# EAGLE design PHOBOS-lbr (EAGLE 7.6.0)
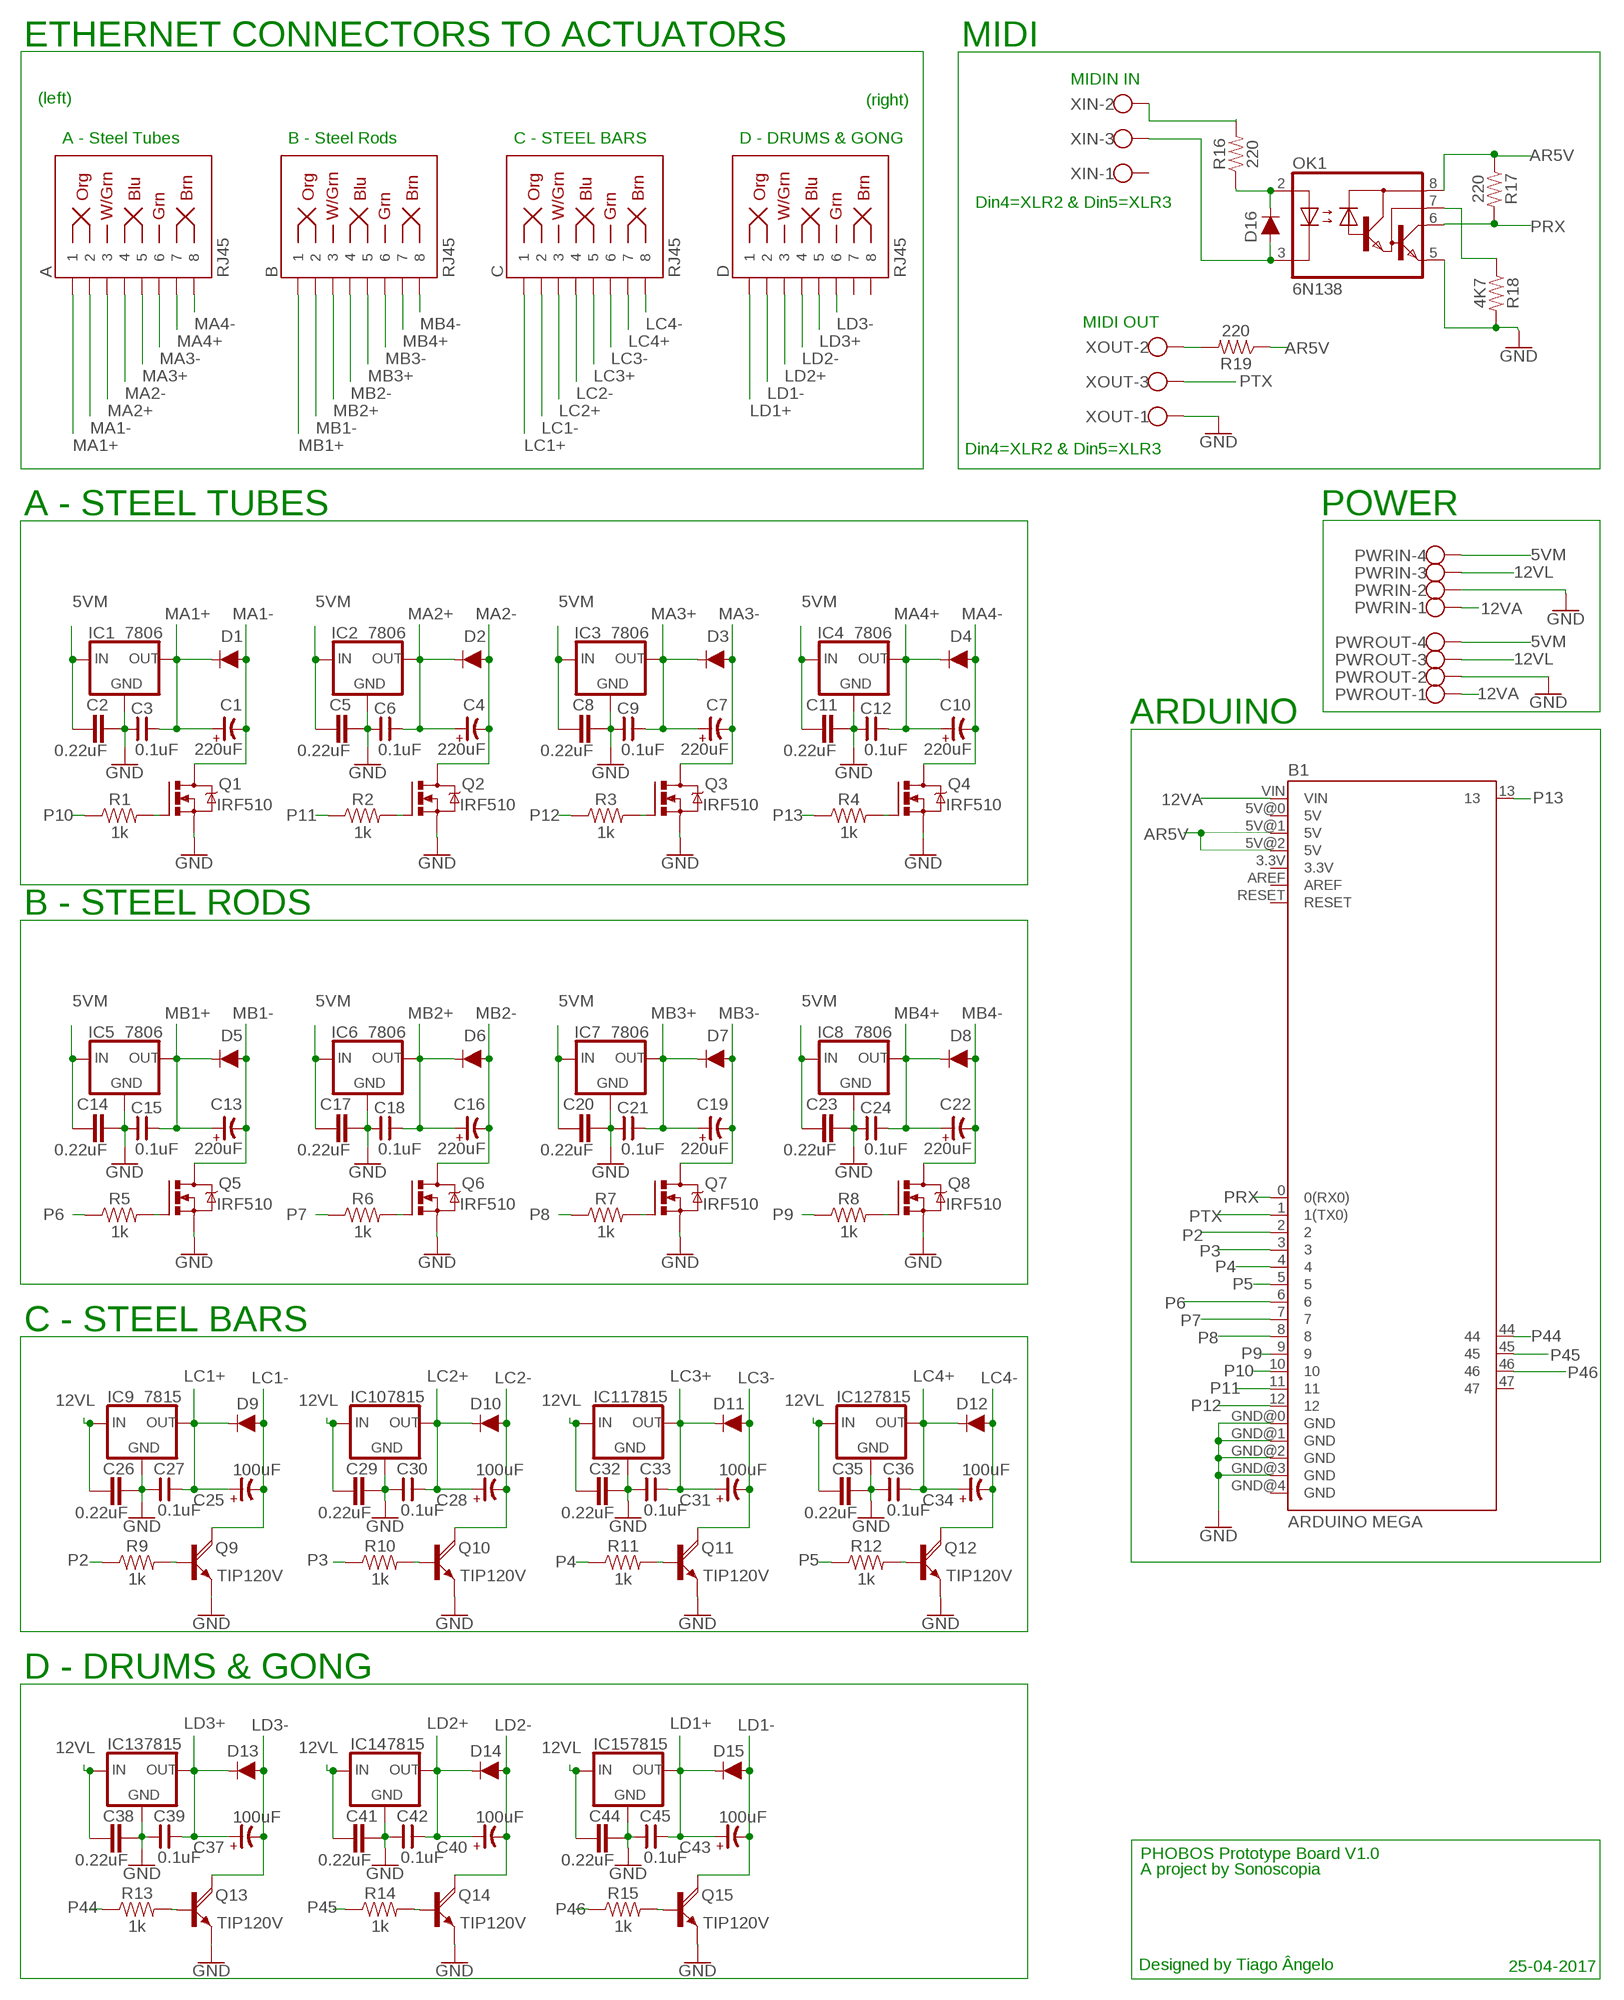
[diagram p0: schematic, sheet 1]

## Parts
A  RJ45  RJ45-8  [RJ45-8]
B  RJ45  RJ45-8  [RJ45-8]
B1  ARDUINO MEGA  ARDUINO_MEGA_R3FULL  [ARDUINO_MEGA]
C  RJ45  RJ45-8  [RJ45-8]
C1  220uF  CP-E-035X080  [E-035X080]
C2  0.22uF  C5/3  [C5B3]
C3  0.1uF  CNP-C025-050X025  [C025-050X025]
C4  220uF  CP-E-035X080  [E-035X080]
C5  0.22uF  C5/3  [C5B3]
C6  0.1uF  CNP-C025-050X025  [C025-050X025]
C7  220uF  CP-E-035X080  [E-035X080]
C8  0.22uF  C5/3  [C5B3]
C9  0.1uF  CNP-C025-050X025  [C025-050X025]
C10  220uF  CP-E-035X080  [E-035X080]
C11  0.22uF  C5/3  [C5B3]
C12  0.1uF  CNP-C025-050X025  [C025-050X025]
C13  220uF  CP-E-035X080  [E-035X080]
C14  0.22uF  C5/3  [C5B3]
C15  0.1uF  CNP-C025-050X025  [C025-050X025]
C16  220uF  CP-E-035X080  [E-035X080]
C17  0.22uF  C5/3  [C5B3]
C18  0.1uF  CNP-C025-050X025  [C025-050X025]
C19  220uF  CP-E-035X080  [E-035X080]
C20  0.22uF  C5/3  [C5B3]
C21  0.1uF  CNP-C025-050X025  [C025-050X025]
C22  220uF  CP-E-035X080  [E-035X080]
C23  0.22uF  C5/3  [C5B3]
C24  0.1uF  CNP-C025-050X025  [C025-050X025]
C25  100uF  CP-E-020X050  [E-020X050]
C26  0.22uF  C5/3  [C5B3]
C27  0.1uF  CNP-C025-050X025  [C025-050X025]
C28  100uF  CP-E-020X050  [E-020X050]
C29  0.22uF  C5/3  [C5B3]
C30  0.1uF  CNP-C025-050X025  [C025-050X025]
C31  100uF  CP-E-020X050  [E-020X050]
C32  0.22uF  C5/3  [C5B3]
C33  0.1uF  CNP-C025-050X025  [C025-050X025]
C34  100uF  CP-E-020X050  [E-020X050]
C35  0.22uF  C5/3  [C5B3]
C36  0.1uF  CNP-C025-050X025  [C025-050X025]
C37  100uF  CP-E-020X050  [E-020X050]
C38  0.22uF  C5/3  [C5B3]
C39  0.1uF  CNP-C025-050X025  [C025-050X025]
C40  100uF  CP-E-020X050  [E-020X050]
C41  0.22uF  C5/3  [C5B3]
C42  0.1uF  CNP-C025-050X025  [C025-050X025]
C43  100uF  CP-E-020X050  [E-020X050]
C44  0.22uF  C5/3  [C5B3]
C45  0.1uF  CNP-C025-050X025  [C025-050X025]
D  RJ45  RJ45-8  [RJ45-8]
D1  1A/50V/1.1V  DIODE-KIT2  [DIODE-1N4001-KIT]
D2  1A/50V/1.1V  DIODE-KIT2  [DIODE-1N4001-KIT]
D3  1A/50V/1.1V  DIODE-KIT2  [DIODE-1N4001-KIT]
D4  1A/50V/1.1V  DIODE-KIT2  [DIODE-1N4001-KIT]
D5  1A/50V/1.1V  DIODE-KIT2  [DIODE-1N4001-KIT]
D6  1A/50V/1.1V  DIODE-KIT2  [DIODE-1N4001-KIT]
D7  1A/50V/1.1V  DIODE-KIT2  [DIODE-1N4001-KIT]
D8  1A/50V/1.1V  DIODE-KIT2  [DIODE-1N4001-KIT]
D9  1A/50V/1.1V  DIODE-KIT2  [DIODE-1N4001-KIT]
D10  1A/50V/1.1V  DIODE-KIT2  [DIODE-1N4001-KIT]
D11  1A/50V/1.1V  DIODE-KIT2  [DIODE-1N4001-KIT]
D12  1A/50V/1.1V  DIODE-KIT2  [DIODE-1N4001-KIT]
D13  1A/50V/1.1V  DIODE-KIT2  [DIODE-1N4001-KIT]
D14  1A/50V/1.1V  DIODE-KIT2  [DIODE-1N4001-KIT]
D15  1A/50V/1.1V  DIODE-KIT2  [DIODE-1N4001-KIT]
D16  200mA/100V/1V  DIODE-1N4148  [DIODE-1N4148]
IC1  7806  78XXS  [78XXS]
IC2  7806  78XXS  [78XXS]
IC3  7806  78XXS  [78XXS]
IC4  7806  78XXS  [78XXS]
IC5  7806  78XXS  [78XXS]
IC6  7806  78XXS  [78XXS]
IC7  7806  78XXS  [78XXS]
IC8  7806  78XXS  [78XXS]
IC9  7815  78XXS  [78XXS]
IC10  7815  78XXS  [78XXS]
IC11  7815  78XXS  [78XXS]
IC12  7815  78XXS  [78XXS]
IC13  7815  78XXS  [78XXS]
IC14  7815  78XXS  [78XXS]
IC15  7815  78XXS  [78XXS]
OK1  6N138  [DIL08]
PWRIN  W237-4  [W237-4]
PWROUT  W237-4  [W237-4]
Q1  IRF510  IRF520  [TO220BV]
Q2  IRF510  IRF520  [TO220BV]
Q3  IRF510  IRF520  [TO220BV]
Q4  IRF510  IRF520  [TO220BV]
Q5  IRF510  IRF520  [TO220BV]
Q6  IRF510  IRF520  [TO220BV]
Q7  IRF510  IRF520  [TO220BV]
Q8  IRF510  IRF520  [TO220BV]
Q9  TIP120V  [TO220AV]
Q10  TIP120V  [TO220AV]
Q11  TIP120V  [TO220AV]
Q12  TIP120V  [TO220AV]
Q13  TIP120V  [TO220AV]
Q14  TIP120V  [TO220AV]
Q15  TIP120V  [TO220AV]
R1  1k  1KOHM-VERT-1/4W-1%  [AXIAL-0.1]
R2  1k  1KOHM-VERT-1/4W-1%  [AXIAL-0.1]
R3  1k  1KOHM-VERT-1/4W-1%  [AXIAL-0.1]
R4  1k  1KOHM-VERT-1/4W-1%  [AXIAL-0.1]
R5  1k  1KOHM-VERT-1/4W-1%  [AXIAL-0.1]
R6  1k  1KOHM-VERT-1/4W-1%  [AXIAL-0.1]
R7  1k  1KOHM-VERT-1/4W-1%  [AXIAL-0.1]
R8  1k  1KOHM-VERT-1/4W-1%  [AXIAL-0.1]
R9  1k  1KOHM-VERT-1/4W-1%  [AXIAL-0.1]
R10  1k  1KOHM-VERT-1/4W-1%  [AXIAL-0.1]
R11  1k  1KOHM-VERT-1/4W-1%  [AXIAL-0.1]
R12  1k  1KOHM-VERT-1/4W-1%  [AXIAL-0.1]
R13  1k  1KOHM-VERT-1/4W-1%  [AXIAL-0.1]
R14  1k  1KOHM-VERT-1/4W-1%  [AXIAL-0.1]
R15  1k  1KOHM-VERT-1/4W-1%  [AXIAL-0.1]
R16  220  1KOHM-HORIZ-1/4W-5%  [AXIAL-0.3]
R17  220  1KOHM-HORIZ-1/4W-5%  [AXIAL-0.3]
R18  4K7  1KOHM-HORIZ-1/4W-5%  [AXIAL-0.3]
R19  220  1KOHM-HORIZ-1/4W-5%  [AXIAL-0.3]
XIN  W237-103  [W237-103]
XOUT  W237-103  [W237-103]

## Nets
5VM [5VM]: C2.1 C5.1 C8.1 C11.1 C14.1 C17.1 C20.1 C23.1 IC1.IN IC2.IN IC3.IN IC4.IN IC5.IN IC6.IN IC7.IN IC8.IN PWRIN.4 PWROUT.4
12VA [12VA]: B1.VIN PWRIN.1 PWROUT.1
12VL [12VL]: C26.1 C29.1 C32.1 C35.1 C38.1 C41.1 C44.1 IC9.IN IC10.IN IC11.IN IC12.IN IC13.IN IC14.IN IC15.IN PWRIN.3 PWROUT.3
AR5V: B1.5V@1(5V) B1.5V@2(5V) OK1.8(VCC) R17.P$1 R19.P$1
GND [GND]: B1.GND@0(GND) B1.GND@1(GND) B1.GND@2(GND) B1.GND@3(GND) C2.2 C3.1 C5.2 C6.1 C8.2 C9.1 C11.2 C12.1 C14.2 C15.1 C17.2 C18.1 C20.2 C21.1 C23.2 C24.1 C26.2 C27.1 C29.2 C30.1 C32.2 C33.1 C35.2 C36.1 C38.2 C39.1 C41.2 C42.1 C44.2 C45.1 IC1.GND IC2.GND IC3.GND IC4.GND IC5.GND IC6.GND IC7.GND IC8.GND IC9.GND IC10.GND IC11.GND IC12.GND IC13.GND IC14.GND IC15.GND OK1.5(GND) PWRIN.2 PWROUT.2 Q1.S Q2.S Q3.S Q4.S Q5.S Q6.S Q7.S Q8.S Q9.E Q10.E Q11.E Q12.E Q13.E Q14.E Q15.E R18.P$2 XOUT.1
LC1+: C25.+ C27.2 C.1 D9.C IC9.OUT
LC1-: C25.- C.2 D9.A Q9.C
LC2+: C28.+ C30.2 C.3 D10.C IC10.OUT
LC2-: C28.- C.4 D10.A Q10.C
LC3+: C31.+ C33.2 C.5 D11.C IC11.OUT
LC3-: C31.- C.6 D11.A Q11.C
LC4+: C34.+ C36.2 C.7 D12.C IC12.OUT
LC4-: C34.- C.8 D12.A Q12.C
LD1+: C43.+ C45.2 D15.C D.1 IC15.OUT
LD1-: C43.- D15.A D.2 Q15.C
LD2+: C40.+ C42.2 D14.C D.3 IC14.OUT
LD2-: C40.- D14.A D.4 Q14.C
LD3+: C37.+ C39.2 D13.C D.5 IC13.OUT
LD3-: C37.- D13.A D.6 Q13.C
MA1+: A.1 C1.+ C3.2 D1.C IC1.OUT
MA1-: A.2 C1.- D1.A Q1.D
MA2+: A.3 C4.+ C6.2 D2.C IC2.OUT
MA2-: A.4 C4.- D2.A Q2.D
MA3+: A.5 C7.+ C9.2 D3.C IC3.OUT
MA3-: A.6 C7.- D3.A Q3.D
MA4+: A.7 C10.+ C12.2 D4.C IC4.OUT
MA4-: A.8 C10.- D4.A Q4.D
MB1+: B.1 C13.+ C15.2 D5.C IC5.OUT
MB1-: B.2 C13.- D5.A Q5.D
MB2+: B.3 C16.+ C18.2 D6.C IC6.OUT
MB2-: B.4 C16.- D6.A Q6.D
MB3+: B.5 C19.+ C21.2 D7.C IC7.OUT
MB3-: B.6 C19.- D7.A Q7.D
MB4+: B.7 C22.+ C24.2 D8.C IC8.OUT
MB4-: B.8 C22.- D8.A Q8.D
N$1: Q1.G R1.P$2
N$2: R19.P$2 XOUT.2
N$3: Q2.G R2.P$2
N$4: Q10.B R10.P$2
N$5: Q11.B R11.P$2
N$9: Q9.B R9.P$2
N$14: Q3.G R3.P$2
N$15: Q4.G R4.P$2
N$16: Q5.G R5.P$2
N$18: Q6.G R6.P$2
N$19: Q7.G R7.P$2
N$20: Q8.G R8.P$2
N$21: Q12.B R12.P$2
N$22: Q13.B R13.P$2
N$24: Q14.B R14.P$2
N$25: D16.A OK1.3(C) XIN.3
N$26: D16.C OK1.2(A) R16.P$1
N$27: R16.P$2 XIN.2
N$28: Q15.B R15.P$2
N$29: OK1.7(VB) R18.P$1
P2: B1.2 R9.P$1
P3: B1.3 R10.P$1
P4: B1.4 R11.P$1
P5: B1.5 R12.P$1
P6: B1.6 R5.P$1
P7: B1.7 R6.P$1
P8: B1.8 R7.P$1
P9: B1.9 R8.P$1
P10: B1.10 R1.P$1
P11: B1.11 R2.P$1
P12: B1.12 R3.P$1
P13: B1.13 R4.P$1
P44: B1.44 R13.P$1
P45: B1.45 R14.P$1
P46: B1.46 R15.P$1
PRX: B1.0(0(RX0)) OK1.6(VO) R17.P$2
PTX: B1.1(1(TX0)) XOUT.3
Unconnected: B1.3.3V B1.5V@0(5V) B1.47 B1.AREF B1.GND@4(GND) B1.RESET D.7 D.8 XIN.1

## Notes on the sheet
- ETHERNET CONNECTORS TO ACTUATORS | MIDI
- MIDIN IN
- (left) | (right)
- A - Steel Tubes | B - Steel Rods | C - STEEL BARS | D - DRUMS & GONG
- Din4=XLR2 & Din5=XLR3
- MIDI OUT
- Din4=XLR2 & Din5=XLR3
- A - STEEL TUBES | POWER
- ARDUINO
- B - STEEL RODS
- C - STEEL BARS
- D - DRUMS & GONG
- PHOBOS Prototype Board V1.0
- A project by Sonoscopia
- Designed by Tiago Ângelo | 25-04-2017

## Library data of the parts
A B C D = SparkFun-Connectors:RJ45-8: RJ45 Jack - 8 pin Simple RJ45, 8-pin connection. Commonly used for Cat5, Cat5e, and Cat6 Ethernet cables. Here is the connector we sell at SparkFun: RJ45 8-Pin Connector <https://www.sparkfun.com/products/643> (PRT-00643) Datasheet <https://cdn.sparkfun.com/datasheets/Prototyping/04908.pdf> It is used on this SparkFun product: SparkFun RJ45 Breakout <https://www.sparkfun.com/products/716> (BOB-00716) Note, you may also be interested in the "MAGJACK" version of this. It is basically a RJ45 connector, but also has some status LEDs built into the connector housing. You can check that out in this library at the device named "MAGJACK.dev" and see these products online: RJ45 Ethernet MagJack-Compatible <https://www.sparkfun.com/products/8534> (PRT-08534) SparkFun RJ45 MagJack Breakout <https://www.sparkfun.com/products/13021> (BOB-13021); PROD_ID: CONN-08506; SF_ID: PRT-00643
B1 = PHOBOS-Boards:ARDUINO_MEGA_R3: Arduino Mega R3 ATmega2560 R3 compatible footprint. SparkFun Products: Arduino Mega 2560 R3 <https://www.sparkfun.com/products/11061>
C1 C4 C7 C10 C13 C16 C19 C22 C25 C28 C31 C34 C37 C40 C43 = cap-master:CP-: POLARIZED CAP
C2 C5 C8 C11 C14 C17 C20 C23 C26 C29 C32 C35 C38 C41 C44 = capacitor-wima:C: CAPACITOR naming: grid - package width
C3 C6 C9 C12 C15 C18 C21 C24 C27 C30 C33 C36 C39 C42 C45 = cap-master:CNP-: NON-POLARIZED CAP
D1-D15 = SparkFun-DiscreteSemi:DIODE: Diode These are standard reverse protection diodes and small signal diodes. SparkFun Products: SparkFun SparkPunk Sound Kit <https://www.sparkfun.com/products/11177> SparkFun ESP8266 Thing <https://www.sparkfun.com/products/13231>; PROD_ID: DIO-09176
D16 = SparkFun-DiscreteSemi:DIODE: Diode These are standard reverse protection diodes and small signal diodes. SparkFun Products: SparkFun SparkPunk Sound Kit <https://www.sparkfun.com/products/11177> SparkFun ESP8266 Thing <https://www.sparkfun.com/products/13231>; PROD_ID: DIO-08378
IC1-IC15 = v-reg:78XXS: VOLTAGE REGULATOR
OK1 = optocoupler:6N138: MOTOROLA OPTO COUPLER; MF: VISHAY/TELEFUNKEN; MPN: 6N138; OC_FARNELL: 9860150; OC_NEWARK: 35K5294
PWRIN PWROUT = con-wago-500:W237-4: WAGO SCREW CLAMP; OC_FARNELL: unknown; OC_NEWARK: unknown
Q1-Q8 = transistor-power:IRF520: HEXFET Power MOSFET
Q9-Q15 = rocketfarm:TIP120: NPN DARLINGTON TRANSISTOR
R1-R15 = SparkFun-Resistors:1KOHM: 1kΩ resistor A resistor is a passive two-terminal electrical component that implements electrical resistance as a circuit element. Resistors act to reduce current flow, and, at the same time, act to lower voltage levels within circuits. - Wikipedia; PROD_ID: RES-12182
R16-R19 = SparkFun-Resistors:1KOHM: 1kΩ resistor A resistor is a passive two-terminal electrical component that implements electrical resistance as a circuit element. Resistors act to reduce current flow, and, at the same time, act to lower voltage levels within circuits. - Wikipedia; PROD_ID: RES-08380; VALUE: 1k
XIN XOUT = con-wago-500:W237-103: WAGO SCREW CLAMP; MPN: 237-103; OC_FARNELL: unknown; OC_NEWARK: 18M7116

## Net classes
0 default: width 0.508 mm, drill 0.508 mm, clearance 0.406 mm
1 GND: width 1.016 mm, drill 0.508 mm, clearance 0.508 mm
2 5VM: width 1.016 mm, drill 0.508 mm, clearance 0.508 mm
3 12VL: width 0.61 mm, drill 0.508 mm, clearance 0.508 mm
4 12VA: width 0.508 mm, drill 0.508 mm, clearance 0.508 mm

## Board
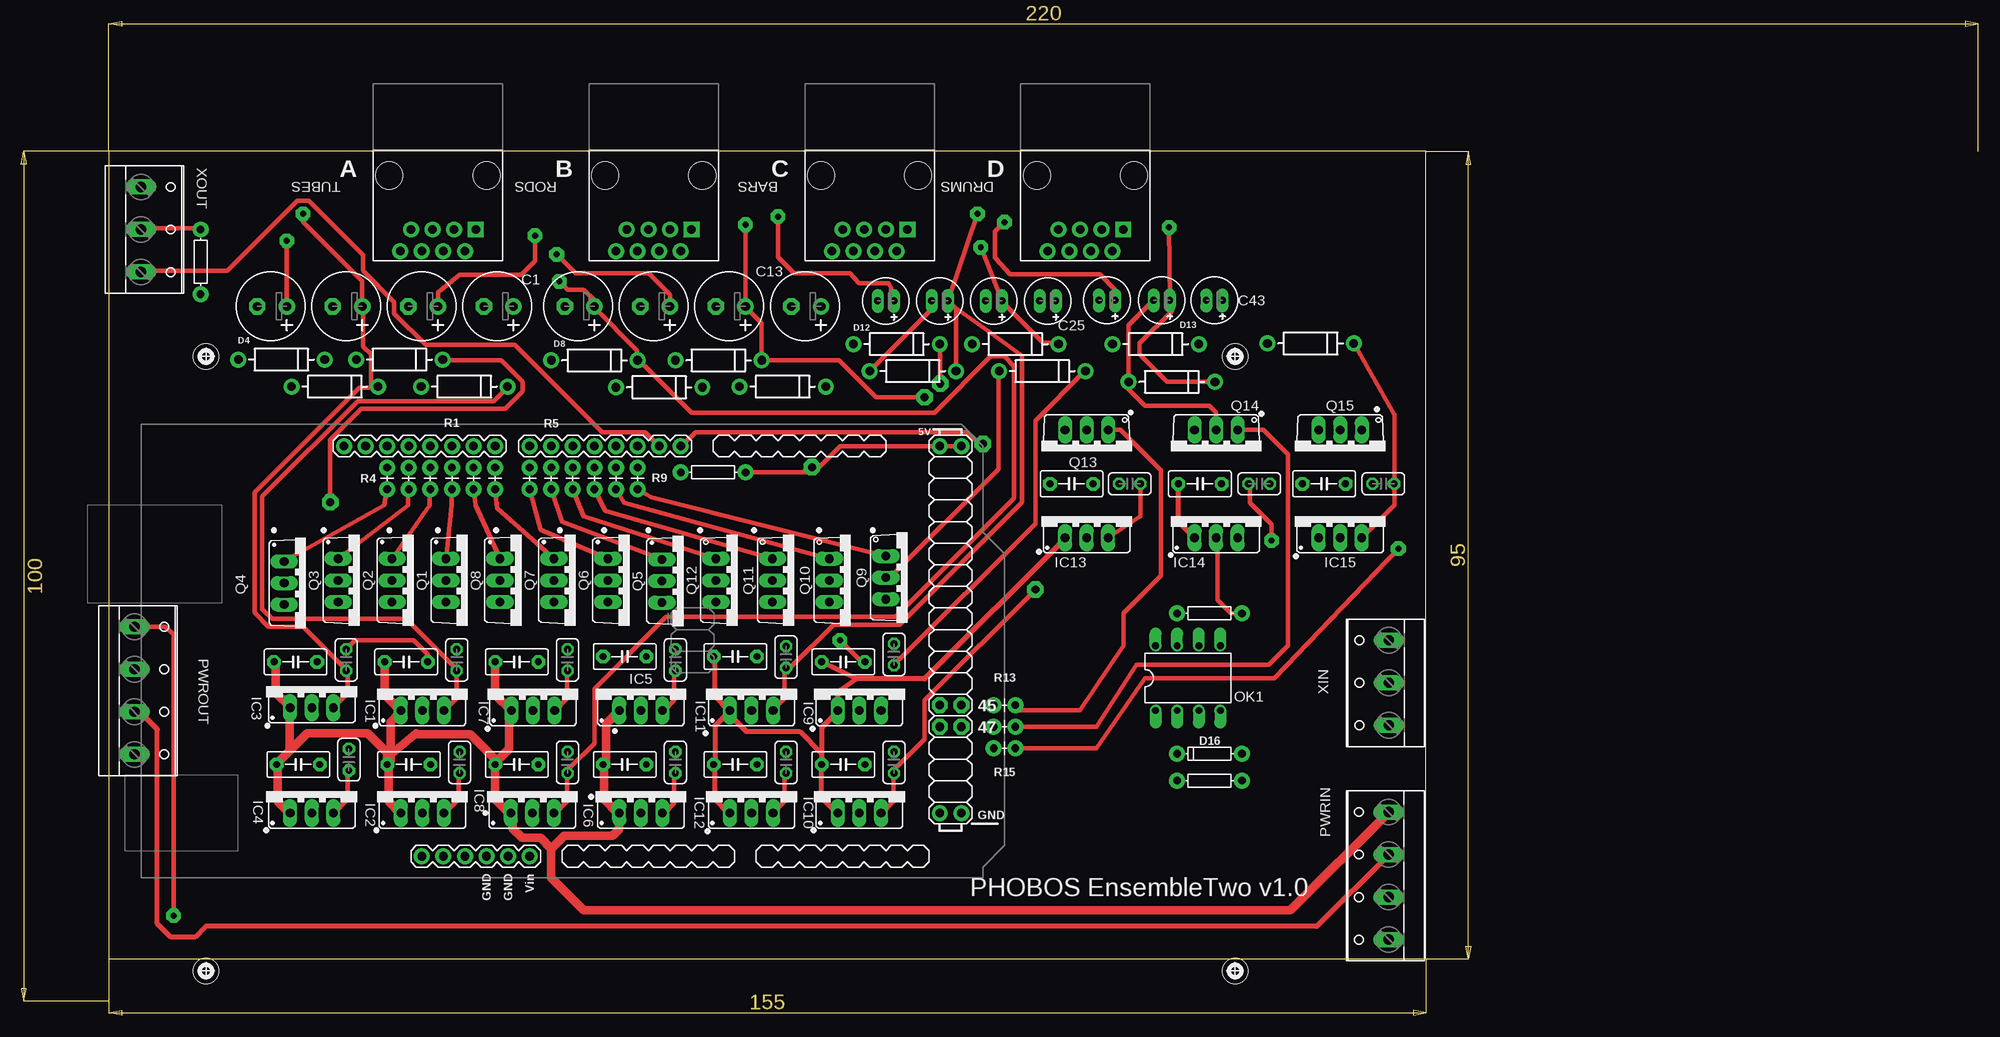
[diagram p1: board, top side]
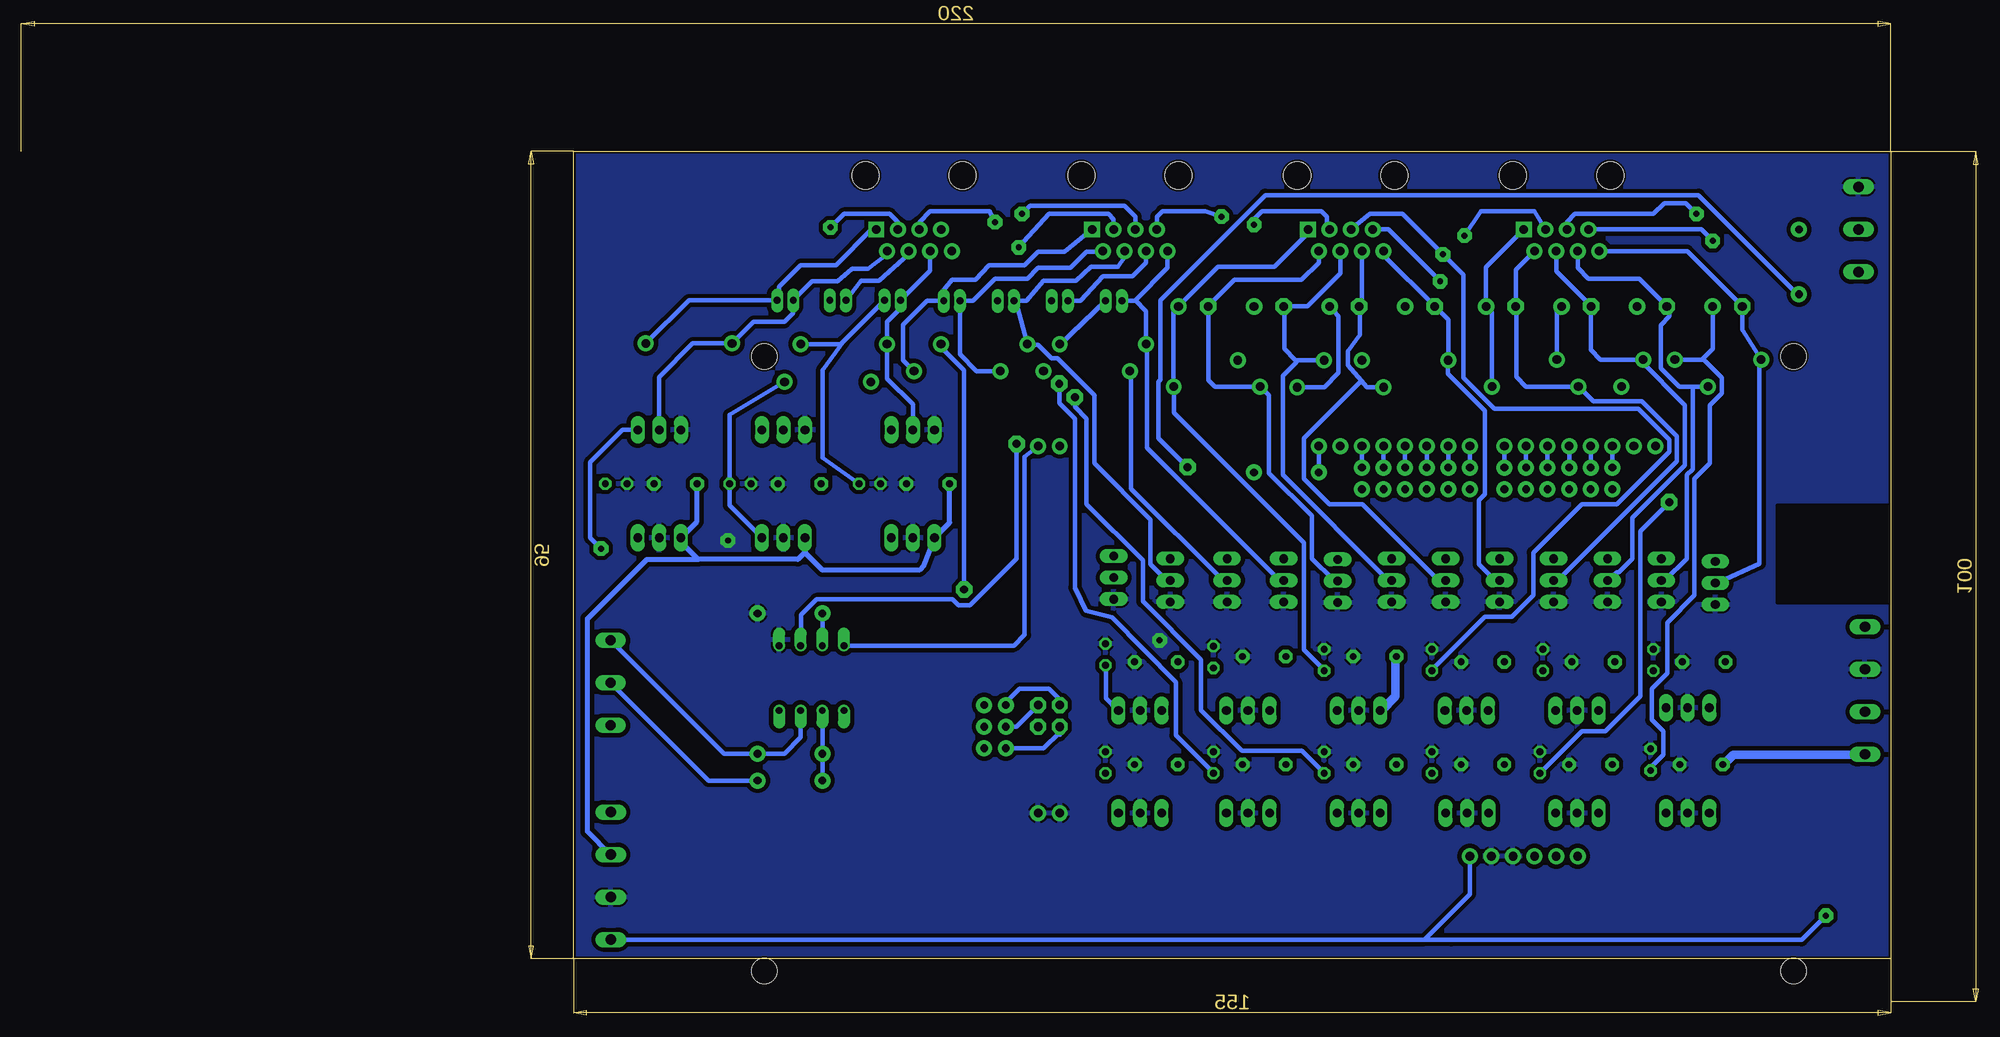
[diagram p2: board, bottom side, seen from below]

Size 155 x 95 mm. Coordinates in mm from the lower left corner, seen from the top.
Outline: 0,0 155,0 155,95 0,95 0,0
Copper layers (1*16): Top 0.035mm / dielectric 1.5mm / Bottom 0.035mm
Design rules "Dek": minimum track width 12mil, minimum drill 36mil, track to track 12mil, track to pad 12mil, pad to pad 12mil, via to via 12mil, smd to smd 0mil, copper to edge 10mil, drill to drill 12mil, minimum pad ring 12mil, minimum via ring 20mil, stop-mask expansion 4mil, vias tented up to drill 25mil, thermal gap 10mil
Holes 3 mm at 132.55,70.87 132.55,-1.43 11.45,-1.43 11.45,70.87
tRestrict: area 30.5,81.3 to 47,102.9; area 55.9,81.3 to 72.4,102.9; area 81.3,81.3 to 97.8,102.9; area 106.7,81.3 to 123.2,102.9
bRestrict: area -2.5,41.9 to 13.3,53.3
vRestrict: area 71.1,59.1 to 91.4,61.6; area 96.5,31.1 to 101.6,59.1; area 96.5,18.4 to 101.6,26; area 53.3,10.8 to 73.7,13.3; area 76.2,10.8 to 96.5,13.3; area -2.5,41.9 to 13.3,53.3

### Footprints (pad centres in the part's own frame; a part is rotated, then mirrored left to right if it is on the bottom)
RJ45-8 = drill 1 pad 1.88 square: 1 -4.445,6.35 | drill 1 pad 1.88: 2 -3.175,8.89; 3 -1.905,6.35; 4 -0.635,8.89; 5 0.635,6.35; 6 1.905,8.89; 7 3.175,6.35; 8 4.445,8.89 | hole 3.2: -5.715,0; 5.715,0
ARDUINO_MEGA = drill 1.016 pad 1.88: 0 13.97,24.13; 1 11.43,24.13; 2 8.89,24.13; 3 6.35,24.13; 3.3V -13.97,-24.13; 4 3.81,24.13; 5 1.27,24.13; 5V@0 -11.43,-24.13; 5V@1 44.45,24.13; 5V@2 46.99,24.13; 6 -1.27,24.13; 7 -3.81,24.13; 8 -7.874,24.13; 9 -10.414,24.13; 10 -12.954,24.13; 11 -15.494,24.13; 12 -18.034,24.13; 13 -20.574,24.13; AREF -25.654,24.13; GND@0 -8.89,-24.13; GND@1 -6.35,-24.13; GND@2 44.45,-19.05; GND@3 46.99,-19.05; GND@4 -23.114,24.13; RESET -16.51,-24.13; VIN -3.81,-24.13 | drill 1.016 pad 1.88 octagon: 44 44.45,-6.35; 45 46.99,-6.35; 46 44.45,-8.89; 47 46.99,-8.89
E-035X080 = drill 1.016 pad 1.93: + -1.905,0 | drill 1.016 pad 1.93 octagon: - 1.587,0
C5B3 = drill 0.813 pad 1.6 octagon: 1 -2.54,0; 2 2.54,0
C025-050X025 = drill 0.813 pad 1.422 octagon: 1 -1.27,0; 2 1.27,0
E-020X050 = drill 0.813 long: + -0.953,0; - 0.953,0
DIODE-1N4001-KIT = drill 1.016 pad 1.88: A -5.08,0; C 5.08,0
DIODE-1N4148 = drill 0.9 pad 1.88: A -3.81,0; C 3.81,0
78XXS = drill 1.016 long: GND 0,-2.54; IN -2.54,-2.54; OUT 2.54,-2.54
DIL08 = drill 0.813 offset: 1 -3.81,-3.81; 2 -1.27,-3.81; 3 1.27,-3.81; 4 3.81,-3.81; 5 3.81,3.81; 6 1.27,3.81; 7 -1.27,3.81; 8 -3.81,3.81
W237-4 = drill 1.194 long: 1 -7.5,-1.27; 2 -2.5,-1.27; 3 2.5,-1.27; 4 7.5,-1.27
TO220BV = drill 1.016 long: D 0,-2.54; G -2.54,-2.54; S 2.54,-2.54
TO220AV = drill 1.016 long: B -2.54,-2.54; C 0,-2.54; E 2.54,-2.54
AXIAL-0.1 = drill 0.9 pad 1.88: P$1 -1.27,0; P$2 1.27,0
AXIAL-0.3 = drill 0.9 pad 1.88: P$1 -3.81,0; P$2 3.81,0
W237-103 = drill 1.194 long: 1 -5,-1.29; 2 0,-1.29; 3 5,-1.29

### Placement (x,y rotation side)
A  38.73,92.15 180 top
B  64.14,92.15 180 top
B1  53.34,36.2 0 top
C  89.53,92.15 180 top
C1  45.72,76.76 180 top
C2  35,34.93 0 top
C3  40.96,35.17 270 top
C4  36.83,76.76 180 top
C5  35.32,22.86 0 top
C6  41.27,23.1 270 top
C7  27.94,76.76 180 top
C8  21.98,34.93 0 top
C9  27.94,35.17 270 top
C10  19.05,76.76 180 top
C11  22.3,22.86 0 top
C12  28.26,23.42 270 top
C13  81.92,76.76 180 top
C14  60.72,35.56 0 top
C15  66.67,35.17 270 top
C16  73.03,76.76 180 top
C17  60.72,22.86 0 top
C18  66.67,23.1 270 top
C19  64.14,76.76 180 top
C20  48.02,34.93 0 top
C21  53.98,35.17 270 top
C22  55.24,76.76 180 top
C23  48.02,22.86 0 top
C24  53.98,23.1 270 top
C25  110.49,77.39 180 top
C26  86.44,34.93 0 top
C27  92.39,35.8 270 top
C28  104.14,77.39 180 top
C29  86.44,22.86 0 top
C30  92.39,23.1 270 top
C31  97.79,77.39 180 top
C32  73.73,35.56 0 top
C33  79.69,35.48 270 top
C34  91.44,77.39 180 top
C35  73.73,22.86 0 top
C36  79.69,23.1 270 top
C37  117.47,77.47 180 top
C38  113.3,55.88 0 top
C39  120.15,55.88 0 top
C40  123.9,77.47 180 top
C41  128.41,55.88 0 top
C42  135.39,55.88 0 top
C43  130.1,77.47 180 top
C44  143.01,55.88 0 top
C45  150,55.88 0 top
D  114.94,92.15 180 top
D1  41.84,67.31 0 top
D2  34.22,70.48 0 top
D3  26.59,67.31 0 top
D4  20.32,70.48 0 top
D5  79.3,67.31 0 top
D6  71.75,70.41 0 top
D7  64.77,67.23 0 top
D8  57.15,70.41 0 top
D9  109.86,69.14 0 top
D10  106.68,72.31 0 top
D11  94.61,69.14 0 top
D12  92.71,72.31 0 top
D13  123.19,72.31 0 top
D14  125.09,67.87 0 top
D15  141.43,72.39 0 top
D16  129.54,24.13 180 top
IC1  36.91,31.75 0 top
IC2  36.91,19.69 0 top
IC3  23.89,32.07 0 top
IC4  23.89,19.69 0 top
IC5  62.62,31.75 0 top
IC6  62.62,19.69 0 top
IC7  49.92,31.75 0 top
IC8  49.85,19.69 0 top
IC9  88.34,31.75 0 top
IC10  88.34,19.69 0 top
IC11  75.64,31.75 0 top
IC12  75.64,19.69 0 top
IC13  115.07,52.07 0 top
IC14  130.31,52.07 0 top
IC15  144.91,52.07 0 top
OK1  127,33.02 0 top
PWRIN  149.35,9.76 90 top
PWROUT  4.3,31.55 270 top
Q1  42.23,44.52 270 top
Q2  35.88,44.52 270 top
Q3  29.53,44.52 270 top
Q4  23.18,44.21 270 top
Q5  67.63,44.45 270 top
Q6  61.28,44.52 270 top
Q7  54.93,44.52 270 top
Q8  48.58,44.52 270 top
Q9  93.98,44.84 270 top
Q10  87.31,44.52 270 top
Q11  80.64,44.52 270 top
Q12  73.98,44.52 270 top
Q13  115.07,59.69 180 top
Q14  130.31,59.69 180 top
Q15  144.91,59.69 180 top
R1  40.39,56.52 270 top
R2  37.85,56.52 270 top
R3  35.31,56.52 270 top
R4  32.77,56.52 270 top
R5  52.07,56.52 270 top
R6  49.53,56.52 270 top
R7  45.47,56.52 270 top
R8  42.93,56.52 270 top
R9  62.23,56.52 270 top
R10  59.69,56.52 270 top
R11  57.15,56.52 270 top
R12  54.61,56.52 270 top
R13  105.41,29.84 0 top
R14  105.41,27.3 0 top
R15  105.41,24.77 0 top
R16  129.54,20.95 0 top
R17  71.12,57.23 180 top
R18  129.54,40.64 0 top
R19  10.79,81.99 90 top
XIN  149.35,32.46 90 top
XOUT  5.08,85.8 270 top

### Tracks (layer width: path | path; a pad name or v marks a point on that pad's centre or on a via)
5VM
  Top 1.016: PWRIN.4 139.07,5.71 55.88,5.71 52.07,9.53 52.07,12.95 | IC5.IN 59.89,29.03 58.52,27.66 58.52,23.32 C17.1 58.29,22.86 58.29,18.74 59.89,17.15 IC6.IN 60.07,17.13 60.07,15.24 59.31,14.48 53.59,14.48 52.07,12.95 | C20.1 45.49,34.75 45.49,31.09 47.32,29.26 IC7.IN 47.09,28.8 47.09,24.69 45.72,23.32 C23.1 | C23.1 45.49,18.74 47.09,17.15 IC8.IN 47.55,16.69 47.55,15.32 48.64,14.22 50.8,14.22 52.07,12.95 | C5.1 32.92,22.86 32.92,18.52 34.29,17.15 IC2.IN | C2.1 32.46,34.75 32.46,31.09 34.29,29.26 IC1.IN 34.06,28.8 33.15,27.89 33.15,24.13 | 33.15,24.13 33.15,23.32 C5.1 | C8.1 19.66,34.75 19.66,31.32 21.26,29.72 IC3.IN 21.26,29.03 21.26,24.46 | IC4.IN 21.26,17.15 19.89,18.52 19.89,22.86 C11.1 20.12,23.32 21.26,24.46 | 21.26,24.46 23.34,26.54 30.48,26.54 32.78,24.25 C5.1 | 33.15,24.13 33.27,24.13 36.2,26.54 36.32,26.42 42.55,26.42 45.48,23.48 C23.1
  Bottom 1.016: C14.1 58.29,35.43 58.29,30.86 59.89,29.26 IC5.IN | PWROUT.4 3.2,24 18.52,24 19.66,22.86 C11.1
12VA  (via drill 0.7)
  Top 0.508: PWROUT.1 6.67,39.05 7.62,38.1 v7.62,5.08
  Bottom 0.508: PWRIN.1 54.89,2.26 | 54.89,2.26 49.53,7.62 B1.VIN | v7.62,5.08 10.48,2.22 51.75,2.22 52.35,2.26 54.89,2.26
12VL
  Top 0.61: IC14.IN 125.86,51.44 C41.1 | PWRIN.3 142.17,3.81 11.43,3.81 10.16,2.54 7.3,2.54 5.71,4.13 5.71,26.99 3.65,29.05 PWROUT.3 | IC12.IN 72.92,17.15 71.32,18.74 71.32,22.86 C35.1 71.32,23.09 71.32,27.43 72.92,29.03 IC11.IN | C32.1 71.32,35.43 71.32,30.86 72.92,29.26 IC11.IN | IC10.IN 85.72,17.15 83.9,18.97 C29.1 83.9,23.09 83.9,24.13 | 88.02,32.92 85.8,31.41 85.72,29.26 IC9.IN 85.72,29.03 83.9,27.2 83.9,24.13 | 83.9,35.43 C26.1 88.02,32.92 | IC11.IN 72.92,28.8 74.98,26.75 81.28,26.75 83.9,24.13 | 88.02,32.92 96.01,32.92 112.47,49.38 IC13.IN
  Bottom 0.61: C38.1 110.76,51.3 IC13.IN 113.8,46.22 114.3,45.72 125.73,45.72 127.77,47.76 IC14.IN 127.77,47.81 128.59,46.99 140.34,46.99 | C44.1 140.47,51.44 IC15.IN 142.38,49.03 140.34,46.99 | PWRIN.3 153.35,14.99 153.35,40.01 146.37,46.99 140.34,46.99
AR5V  (via drill 0.91)
  Top 0.508: R17.P$1 82.94,57.23 83.15,57.44 | 83.15,57.44 86.04,60.33 B1.5V@1 B1.5V@2 | 83.15,57.44 v82.75,57.84
  Bottom 0.508: OK1.8 103.19,36.83 101.92,38.1 101.92,59.06 B1.5V@2 | v82.75,57.84 86.18,61.27 86.18,67.89 85.95,68.12 85.95,77.5 73.61,89.84 22.63,89.84 10.97,78.18 R19.P$1
GND  (via drill 0.7)
  Top 0.508: R18.P$2 132.08,40.64 130.49,42.23 130.49,49.35 IC14.GND | v136.84,49.21 136.84,51.12 134.3,53.66 134.3,55.7 C42.1 | C9.1 28.97,37.47 35.88,37.47 37.54,35.8 C2.2 | v86.04,37.47 88.58,34.93 C26.2
  pour Bottom: -5.08,99.06 160.02,99.06 160.02,-5.08 -5.08,-5.08
LC1+
  Top 0.508: C27.2 92.58,34.75 109.04,51.21 109.04,63.32 114.76,69.04 D9.C
  Bottom 0.508: C.1 97.23,83.19 100.33,83.19 101.92,81.6 106.11,81.6 107.7,79.88 110.49,79.88 111.44,78.68 C25.+ 113.42,77.39 116.2,74.61 116.2,70.41 D9.C | C27.2 92.35,34.52 92.35,30.63 90.98,29.26 IC9.OUT
LC1-
  Top 0.508: Q9.C 91.44,45.03 92.13,45.03 104.7,57.61 104.7,69.04 D9.A
  Bottom 0.508: C.2 92.78,83.19 94.61,83.19 96.52,81.28 100.33,81.28 101.6,80.01 105.41,80.01 108.03,77.39 C25.- 109.54,71.12 107.56,69.14 D9.A
LC2+  (via drill 0.7, 0.91)
  Top 0.508: v102.62,83.69 C28.+ 105.16,77.27 109.96,72.47 111.56,72.47 D10.C | IC10.OUT 90.98,17.15 92.35,18.52 92.35,21.72 C30.2 92.58,21.95 92.58,22.4 96.01,25.83 96.01,30.4 v109.04,43.43
  Bottom 0.508: C.3 91.44,87 92.08,87.63 99.06,87.63 v102.62,83.69 | v109.04,43.43 109.04,69.27 111.56,71.78 111.56,72.24 D10.C
LC2-
  Bottom 0.508: C.4 90.17,82.55 90.93,81.41 94.11,81.41 95.89,79.76 99.69,79.76 101.67,77.39 C28.- 102.87,77.08 D10.A 101.5,72.24 100.36,72.24 98.75,70.64 98.07,70.64 93.73,66.29 93.73,58.29 87.1,51.66 87.1,46.41 85.27,44.58 84.81,44.58 Q10.C
LC3+  (via drill 0.7)
  Top 0.508: v102.23,87.63 C31.+ 98.82,77.39 99.54,76.68 | D11.C 99.69,76.52 99.54,76.68 | IC11.OUT 78.18,29.26 79.55,30.63 79.55,34.06 C33.2 79.78,34.29 80.24,34.29 85.27,39.32 93.04,39.32 107.44,53.72 107.44,70.94 103.56,73.81 99.54,76.68
  Bottom 0.508: C.5 88.9,87.31 90.17,88.58 101.28,88.58 v102.23,87.63
  Bottom 0.61: 99.14,77.39 C31.+
LC3-
  Top 0.508: D11.A 96.84,76.44 C31.-
  Bottom 0.508: C31.- 95.33,77.39 92.71,80.33 89.22,80.33 87.63,81.92 C.6 | Q11.C 78.18,44.58 78.64,44.58 89.38,55.32 89.38,69.04 D11.A
LC4+  (via drill 0.7, 0.91)
  Top 0.508: v78.74,87.31 78.74,82.55 80.64,80.64 87.25,80.64 88.27,79.5 91.76,79.5 92.08,78.93 92.08,77.71 C34.+ | C36.2 79.55,21.72 79.55,18.52 IC12.OUT | v97.84,67.67 97.84,72.24 D12.C
  Bottom 0.508: C.7 86.36,87.31 85.72,87.95 80.64,87.95 v78.74,87.31 | v97.84,67.67 97.84,65.38 96.01,63.55 96.01,43.66 94.69,40.95 91.67,40.18 84.12,32.51 84.12,26.29 79.78,21.95 C36.2
  Bottom 0.61: D12.C C34.+
LC4-
  Bottom 0.508: C34.- 88.97,77.39 88.9,77.47 | 88.9,77.47 85.09,81.28 C.8 | 88.9,77.47 87.63,76.2 D12.A 87.55,72.24 87.55,60.12 72.01,44.58 71.55,44.58 Q12.C
LD1+
  Top 0.508: D15.C 151.26,64 C45.2 151.26,53.34 IC15.OUT
  Bottom 0.508: D.1 119.94,85.8 124.14,81.6 128.27,81.6 130.81,79.06 130.81,77.71 C43.+ 141.43,77.47 D15.C
LD1-
  Bottom 0.508: D.2 118.11,82.87 120.33,81.15 122.24,81.15 123.95,79.69 126.92,79.69 C43.- 129.15,75.96 130.18,74.93 133.81,74.93 D15.A 140.97,72.39 144.91,68.45 Q15.C
LD2+  (via drill 0.7)
  Top 0.508: v124.78,86.04 C40.+ 125.09,77.23 125.09,76.2 121.28,72.39 121.28,71.12 124.53,67.87 D14.C
  Bottom 0.508: IC14.OUT 136.66,53.34 C42.2 136.66,64 D14.C | D.3 116.84,86.68 117.79,87.63 123.19,87.63 v124.78,86.04
LD2-
  Top 0.508: C40.- 120.02,74.54 D14.A 120.02,66.99 121.92,65.09 129.54,65.09 130.31,64.32 Q14.C
  Bottom 0.508: D.4 115.57,82.87 119.06,79.76 121.17,79.76 C40.-
LD3+  (via drill 0.7)
  Top 0.508: IC13.OUT 121.42,52.07 C39.2 | C37.+ 118.43,78.74 116.65,80.52 106.05,80.52 104.33,82.42 104.27,82.49 104.27,85.6 105.35,86.68 v105.41,86.68
  Bottom 0.508: D13.C 123.58,72.31 123.19,72.71 | 123.19,72.71 C37.+ | C39.2 125.73,58.92 125.73,69.22 123.19,72.71 | D.5 114.3,86.68 113.03,87.95 106.05,87.95 v105.41,86.68
LD3-
  Bottom 0.508: D.6 113.03,80.96 C37.- 116.52,76.52 118.11,74.93 D13.A 118.11,68.26 115.07,65.22 Q13.C
MA1+
  Top 0.508: IC1.OUT 39.55,29.26 40.92,30.63 40.92,33.83 C3.2 40.92,34.06 34.98,40.01 19.2,40.01 18.06,41.15 18.06,54.41 29.26,65.61 45.26,65.61 46.86,67.21 D1.C
  Bottom 0.508: A.1 47.62,81.36 C1.+ 46.91,76.05 D1.C
MA1-
  Bottom 0.508: A.2 44.13,81.04 C1.- 44.07,76.7 44.07,68.45 42.93,67.31 D1.A 36.58,67.21 34.98,65.61 29.26,65.61 25.15,61.49 25.15,58.52 39.09,44.58 39.55,44.58 Q1.D
MA2+  (via drill 0.7, 0.91)
  Top 0.508: v50.16,85.09 50.16,82.11 48.51,80.45 41.27,80.45 38.73,78.42 C4.+ | C6.2 41.15,21.72 41.15,18.74 39.55,17.15 IC2.OUT | v26.06,53.72 26.06,61.04 29.72,64.69 46.63,64.69 48.69,66.75 48.69,67.89 46.18,70.41 39.32,70.41 D2.C
  Bottom 0.508: D2.C 39.3,76.2 C4.+ | A.3 41.91,87.95 48.26,87.95 v50.16,85.09 | v26.06,53.72 29.49,50.29 29.49,30.86 33.6,26.75 36.35,26.75 41.15,21.95 C6.2
MA2-
  Bottom 0.508: A.4 39.37,80.89 C4.- 35.31,76.7 35.31,71.63 34.16,70.48 D2.A 29.49,70.41 24.23,65.15 24.23,58.06 30.4,51.89 30.4,47.09 32,45.49 32.23,45.49 33.15,44.58 Q2.D
MA3+  (via drill 0.7)
  Top 0.508: v22.86,87.63 22.86,86.68 29.84,79.69 C7.+ 29.95,76.58 29.95,72.01 30.86,71.09 30.86,67.44 D3.C 31.55,67.21 29.49,67.21 17.14,54.86 17.14,40.69 18.75,39.09 22.86,39.09 27.89,34.06 C9.2 28.12,33.83 28.12,31.09 27.94,31.04 IC3.OUT
  Bottom 0.508: A.5 38.1,86.68 37.15,87.63 27.94,87.63 26.67,88.9 24.13,88.9 v22.86,87.63
MA3-
  Bottom 0.508: C7.- 29.6,80.01 35.56,80.01 36.83,81.28 A.6 | D3.A 23.32,67.31 | 23.32,67.31 24.89,67.31 27.05,69.47 27.05,74.55 26.04,75.56 26.04,76.44 C7.- | 26.42,76.7 C7.- | 23.32,67.31 23.32,57.61 24,56.92 24,47.09 26.52,44.58 26.98,44.58 Q3.D
MA4+  (via drill 0.7)
  Top 0.508: v20.95,84.45 C10.+ | C12.2 28.12,21.95 28.12,18.74 26.52,17.15 IC4.OUT
  Bottom 0.508: D4.C 22.23,70.48 22.12,70.59 | 22.12,70.59 20.95,71.75 C10.+ | A.7 22.3,85.8 v20.95,84.45 | 22.12,70.59 19.89,68.35 19.89,66.52 21.26,65.15 21.26,58.29 23.09,56.46 23.09,42.75 26.29,39.55 26.29,33.6 28.12,31.77 28.12,28.12 26.75,26.75 26.75,24 28.12,22.63 28.12,22.17 C12.2
MA4-
  Bottom 0.508: A.8 23.96,83.26 C10.- 17.46,73.98 D4.A 15.44,70.41 15.44,46.48 20.12,44.35 20.57,44.35 Q4.D
MB1+
  Top 0.508: C15.2 66.52,33.83 66.52,30.4 65.38,29.26 IC5.OUT
  Bottom 0.508: B.1 68.58,85.34 72.52,81.41 79.17,81.41 C13.+ 84.38,76.2 D5.C 84.35,67.21 84.35,64.24 69.04,48.92 69.04,36.35 66.75,34.06 C15.2
MB1-
  Bottom 0.508: B.2 67.31,81.92 69.34,79.88 77.2,79.88 C13.- 80.26,76.7 80.26,68.07 79.5,67.31 D5.A 74.07,67.21 73.15,66.29 73.15,57.15 68.12,52.12 68.12,47.09 65.61,44.58 65.15,44.58 Q5.D
MB2+  (via drill 0.7, 0.91)
  Top 0.508: v74.93,86.36 C16.+ 74.98,76.58 76.81,74.75 76.81,70.64 D6.C 77.04,70.41 85.95,70.41 90.3,66.06 v96.01,66.06 | C18.2 66.52,21.72 66.52,18.29 65.38,17.15 IC6.OUT
  Bottom 0.508: B.3 66.36,86.12 66.36,87.31 66.99,87.95 73.98,87.95 74.93,87 v74.93,86.36 | v96.01,66.06 96.01,64.92 94.64,63.55 94.64,53.49 88.01,46.86 88.01,42.06 81.15,35.2 81.15,29.26 76.35,24.46 69.27,24.46 66.75,21.95 C18.2
MB2-
  Bottom 0.508: B.4 64.77,80.64 68.66,76.76 C16.- 71.37,76.7 71.37,71.75 70.03,70.41 69.95,70.41 | D6.A 69.95,70.41 | Q6.D 58.75,44.58 59.21,44.58 71.55,56.92 71.55,68.58 69.95,70.18 69.95,70.41
MB3+  (via drill 0.7)
  Top 0.508: v52.7,82.87 54.93,80.64 63.5,80.64 66.04,78.11 C19.+ | C21.2 53.95,33.83 53.95,30.63 52.58,29.26 IC7.OUT
  Bottom 0.508: D7.C 66.62,67.23 65.02,68.96 65.02,75.62 C19.+ | B.5 61.28,87.63 57.47,87.63 v52.7,82.87 52.58,82.75 50.29,80.47 50.29,68.35 46.63,64.69 29.72,64.69 26.06,61.04 26.06,59.67 32.23,53.49 36.35,53.49 42.06,47.78 42.06,42.75 44.58,40.23 47.78,40.23 53.95,34.06 C21.2
MB3-
  Bottom 0.508: B.6 62.23,77.08 C19.- 62.48,76.7 62.48,73.41 63.88,71.5 63.88,69.85 62.32,67.98 | D7.A 61.65,67.23 62.32,67.98 | Q7.D 52.58,44.58 53.26,44.58 62.18,53.49 66.06,53.49 69.04,56.46 69.04,61.27 62.41,67.89 62.32,67.98
MB4+  (via drill 0.7)
  Top 0.508: v53.02,79.69 53.98,78.74 55.88,78.74 57.15,77.47 C22.+ 57.15,76.58 62.18,71.55 62.18,70.64 D8.C 62.41,70.41 68.58,64.24 97.16,64.24 103.78,70.87 105.39,70.87 106.53,69.72 106.53,54.18 92.58,40.23 65.61,40.23 57.15,31.77 57.15,25.38 54.18,22.4 54.18,21.95 C24.2 53.95,21.72 53.95,18.52 52.58,17.15 IC8.OUT
  Bottom 0.508: B.7 59.13,85.8 v53.02,79.69
MB4-
  Bottom 0.508: B.8 59.69,82.79 C22.- 52.07,75.17 D8.A 52.12,70.18 52.12,68.81 47.78,64.47 47.78,54.64 48.46,53.95 48.46,46.41 46.63,44.58 46.18,44.58 Q8.D
N$1
  Top 0.508: Q1.G 40.32,53.34 R1.P$2
N$2
  Top 0.508: XOUT.2 3.89,85.95 10.74,85.95 R19.P$2
N$3
  Top 0.508: Q2.G 37.78,53.34 R2.P$2
N$4
  Top 0.508: Q10.B 60.64,53.66 R10.P$2
N$5
  Top 0.508: Q11.B 58.42,52.7 R11.P$2
N$9
  Top 0.508: Q9.B 63.82,54.29 R9.P$2
N$14
  Top 0.508: R3.P$2 35.24,53.34 Q3.G
N$15
  Top 0.508: Q4.G 32.38,53.34 R4.P$2
N$16
  Top 0.508: Q5.G 53.34,51.44 R5.P$2
N$18
  Top 0.508: Q6.G 50.8,50.48 R6.P$2
N$19
  Top 0.508: Q7.G 45.72,53.02 R7.P$2
N$20
  Top 0.508: Q8.G 43.18,53.34 R8.P$2
N$21
  Top 0.508: Q12.B 55.88,52.07 R12.P$2
N$22
  Top 0.508: R13.P$2 107.31,29.21 114.3,29.21 119.38,36.83 119.38,40.64 123.83,45.09 123.83,57.47 119.06,62.23 Q13.B
N$24
  Top 0.508: R14.P$2 116.2,27.3 120.97,34.61 136.53,34.61 138.75,36.83 138.75,59.37 135.89,62.23 Q14.B
N$25
  Bottom 0.508: OK1.3 128.27,26.03 130.18,24.13 D16.A 137.31,24.13 XIN.3
N$26
  Bottom 0.508: OK1.2 D16.C R16.P$1
N$27
  Bottom 0.508: R16.P$2 139.13,20.95 XIN.2
N$28  (via drill 0.7)
  Top 0.508: R15.P$2 116.2,24.77 121.92,33.02 137.16,33.02 v151.76,48.26
  Bottom 0.508: Q15.B 149.22,62.23 153.03,58.42 153.03,49.53 v151.76,48.26
N$29
  Bottom 0.508: R18.P$1 OK1.7
P2
  Bottom 0.508: B1.2 R9.P$1
P3
  Bottom 0.508: B1.3 R10.P$1
P4
  Bottom 0.508: B1.4 R11.P$1
P5
  Bottom 0.508: B1.5 R12.P$1
P6
  Bottom 0.508: B1.6 R5.P$1
P7
  Bottom 0.508: B1.7 R6.P$1
P8
  Bottom 0.508: B1.8 R7.P$1
P9
  Bottom 0.508: B1.9 R8.P$1
P10
  Bottom 0.508: B1.10 R1.P$1
P11
  Bottom 0.508: B1.11 R2.P$1
P12
  Bottom 0.508: B1.12 R3.P$1
P13
  Bottom 0.508: B1.13 R4.P$1
P44
  Bottom 0.508: R13.P$1 104.14,30.16 102.55,31.75 99.06,31.75 97.79,30.48 B1.44
P45
  Bottom 0.508: R14.P$1 102.87,27.3 B1.45
P46
  Bottom 0.508: 97.79,26.35 97.79,26.67 | 97.79,26.67 B1.46 | R15.P$1 99.69,24.77 97.79,26.67
PRX  (via drill 0.91)
  Top 0.508: v102.87,60.58 102.41,60.58 101.04,61.95 69.04,61.95 67.44,60.35 B1.0
  Bottom 0.508: R17.P$2 B1.0 | v102.87,60.58 102.87,47.09 108.36,41.61 109.73,41.61 110.41,42.29 126.42,42.29 128.25,40.46 128.25,37.03 OK1.6
PTX
  Top 0.508: XOUT.3 3.89,80.92 13.95,80.92 22.17,89.15 23.55,89.15 29.95,82.75 29.95,80.92 33.6,77.27 33.6,75.89 37.26,72.24 47.78,72.24 58.06,61.95 63.09,61.95 64.69,60.35 B1.1

### Text on the board
tNames: PHOBOS EnsembleTwo v1.0
tSilk: TUBES | RODS | BARS | DRUMS